# Altium schematic sheet Sheet1.SchDoc
size A
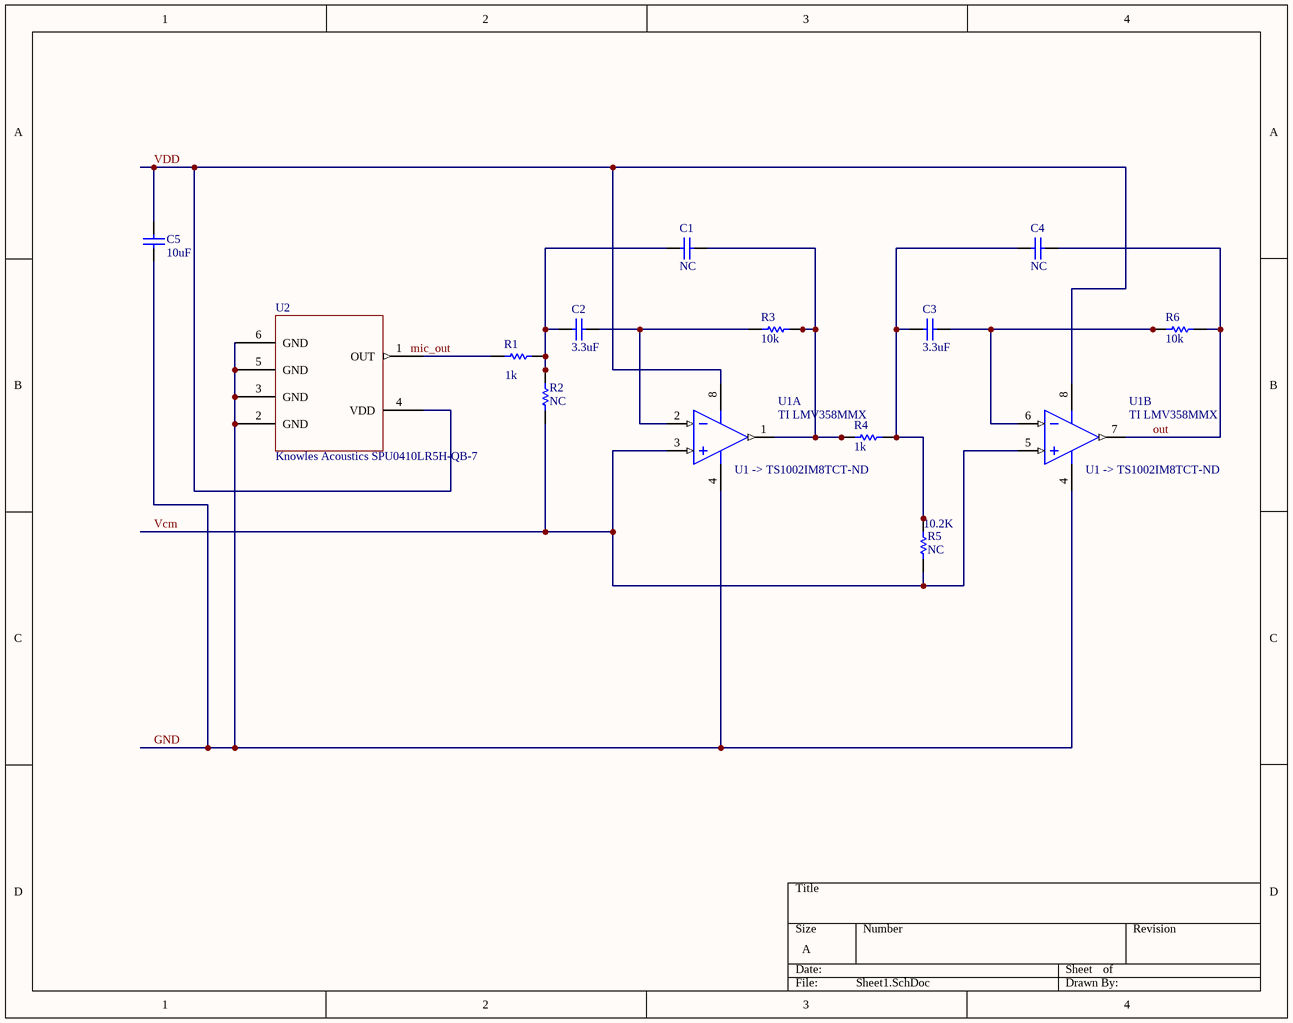
[diagram p0: Sheet1.SchDoc]

## Parts
C1  NC  [CAPC1608X08M]
C2  3.3uF  [CAPC1608X08M]
C3  3.3uF  [CAPC1608X08M]
C4  NC  [CAPC1608X08M]
C5  10uF  [CAPC2013X94X50LL20T25]
R1  1k  [RESC1608X06L]
R2  NC  [RESC1608X06L]
R3  10k  [RESC1608X06L]
R4  1k  [RESC1608X06L]
R5  NC  Resistance: 10.2K  [RESC1608X06L]
R6  10k  [RESC1608X06L]
U1  TI LMV358MMX  [MSOP08]  (parts A,B of 2)
U2  Knowles Acoustics SPU0410LR5H-QB-7  [PCB-fhaaljglxn5h86y57i6s-1]

## Nets
GND: C5.1 U1.4(GND) U2.2(GND) U2.3(GND) U2.5(GND) U2.6(GND)
out: C4.2 R6.2 U1.7(OUT2)
Vcm: R2.1 R5.1 U1.3(IN1+) U1.5(IN2+)
VDD: C5.2 U1.8(VCC+) U2.4(VDD)
NetC1_1: C1.1 C2.1 R1.2 R2.2
NetC1_2: C1.2 R3.2 R4.1 U1.1(OUT1)
NetC2_2: C2.2 R3.1 U1.2(IN1-)
NetC3_1: C3.1 C4.1 R4.2 R5.2
NetC3_2: C3.2 R6.1 U1.6(IN2-)
NetR1_1: R1.1 U2.1(OUT)

## Notes on the sheet
- (near U1) U1 -> TS1002IM8TCT-ND
- Labels drawn without touching a wire or pin: mic_out

## Library data of the parts
C1-C4 = CMP-nocyn7nhex2srcneo663-2: Generic 0603 Capacitor; Body Width: 0.8mm; CustomComponentID: nocyn7nhex2srcneo663
C5 = CMP-126016-2: CAP CER 1500PF 50V 10% X7R 0805; Capacitance: 1.5e-09 F; Case/Package (SI): 2012; Lead-Free Status: Lead Free; Voltage Rating (DC): 50.0 V; Capacitance Tolerance: ±10%; Case/Package: 0805; Dielectric Characteristic: X7R; Mounting Style: Surface Mount; Number of Pins: 2; Octopart Url: https://octopart.com/08055c152kat2a-avx+interconnect+%2F+elco-40100580; OctopartID: c94f02260ecd1688; Packaging: Cut Tape (CT); REACH SVHC Compliance: No SVHC; RoHS: Compliant; Size-Height: 0.00071 m; Size-Length: 0.00201 m; Size-Width: 0.00125 m
R1 R4 = CMP-iebvg68tg8mmdpxr2n2a-5: Generic 0603 Resistor; Body Width: 0.8mm; Tolerance: 1%; Body Height: 0.45mm; Resistance: 48.7K; Body Length: 1.6mm; Package (Imperial): 0603; Package (Metric): 1608; CustomComponentID: iebvg68tg8mmdpxr2n2a
R2 = CMP-iebvg68tg8mmdpxr2n2a-5: Generic 0603 Resistor; Body Width: 0.8mm; Tolerance: 1%; Body Height: 0.45mm; Resistance: 10.2K; Body Length: 1.6mm; Package (Imperial): 0603; Package (Metric): 1608; CustomComponentID: iebvg68tg8mmdpxr2n2a
R3 R6 = CMP-iebvg68tg8mmdpxr2n2a-5: Generic 0603 Resistor; Body Width: 0.8mm; Tolerance: 1%; Body Height: 0.45mm; Resistance: 1.18M; Body Length: 1.6mm; Package (Imperial): 0603; Package (Metric): 1608; CustomComponentID: iebvg68tg8mmdpxr2n2a
R5 = CMP-iebvg68tg8mmdpxr2n2a-5: Generic 0603 Resistor; Body Width: 0.8mm; Tolerance: 1%; Body Height: 0.45mm; Body Length: 1.6mm; Package (Imperial): 0603; Package (Metric): 1608; CustomComponentID: iebvg68tg8mmdpxr2n2a
U1 = CMP-4370069-2: IC OPAMP GP 1MHZ RRO 8VSSOP; Gain Bandwidth Product: 1000000.0 Hz; Input Offset Drift: 5e-06 V/K; Lead-Free Status: Contains Lead; Number of Channels: 2; Output Current: 0.06 A; Slew Rate: 1.0 V/μs; Case/Package: MSOP; Lifecycle Status: Active; Mounting Style: Surface Mount; Number of Circuits: 2; Number of Pins: 8; Octopart Url: https://octopart.com/lmv358mmx-texas+instruments-24850535; OctopartID: a6cd6ebcb3cc790a; Packaging: Reel; RoHS: Non-Compliant
U2 = CMP-9a235714badd45e4-1: Mic Mems Analog Omni -38db; Directivity: Omnidirectional; Sensitivity: -38 dbV/Pa; Acoustic Overload Point: 118 dB SPL; DC Output: 0.73 V; Output Impedance: 400 ohm; Total Harmonic Distortion: 0.15 %; Input Current to Any Pin: +- 5 mA; OUT to Ground: -0.3, Vdd +0.3; Supply Voltage: 3.6 V; Signal to Noise Ratio: 63 db(A); Vdd to Ground: -0.5, +5.0 V; Supply Current: 120 microA; Polarity: Increasing output voltage; OctopartID: 9a235714badd45e4; Temperature Range: -40 to +100 C; Octopart URL: http://octopart.com/spu0410lr5h-qb-7-knowles+acoustics-71107992; Manufacturer Part Number: SPU0410LR5H-QB-7